# EAGLE board InkTimevf (EAGLE 9.7.0)
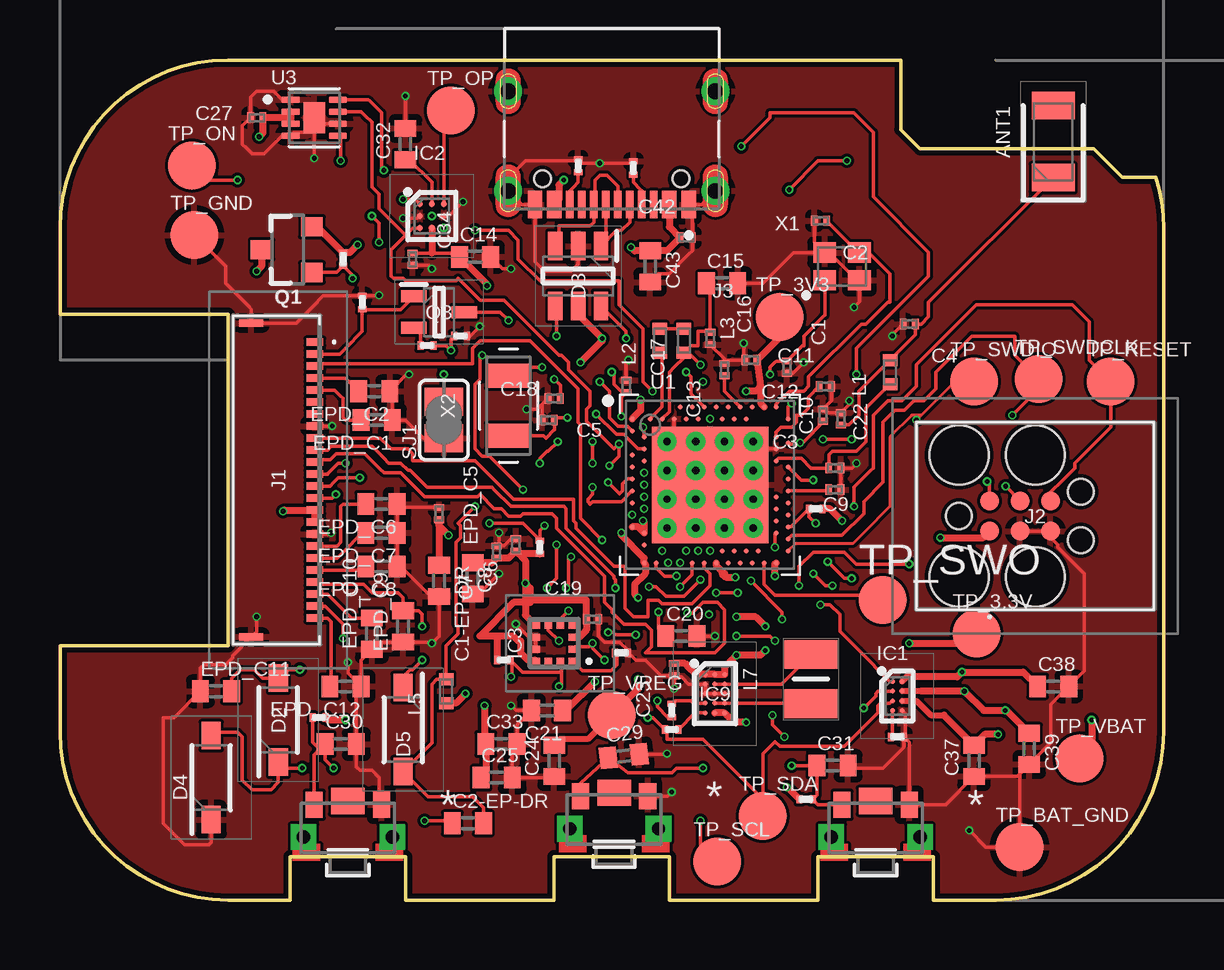
[diagram p5: board, top side]
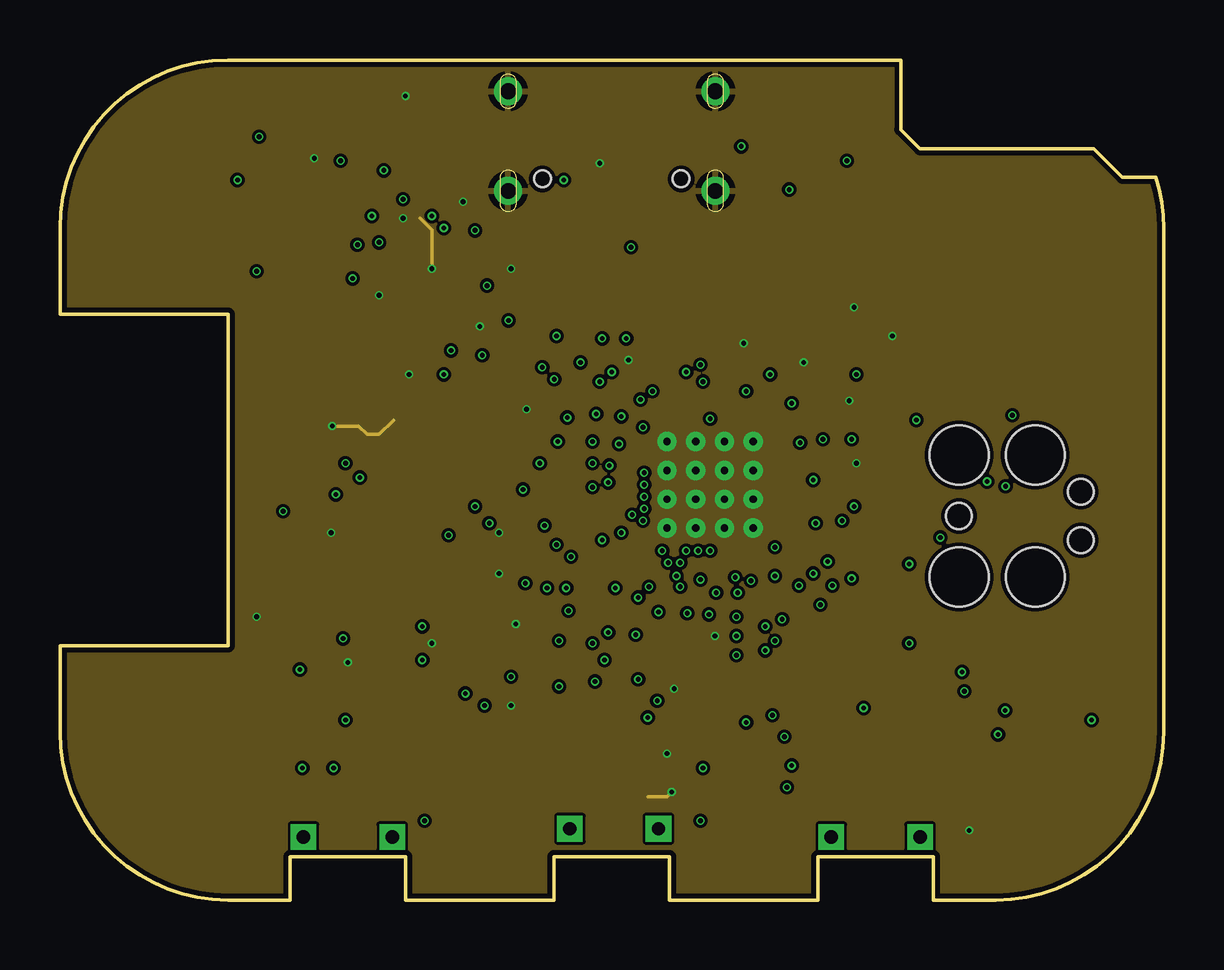
[diagram p6: board, inner layer Route2]
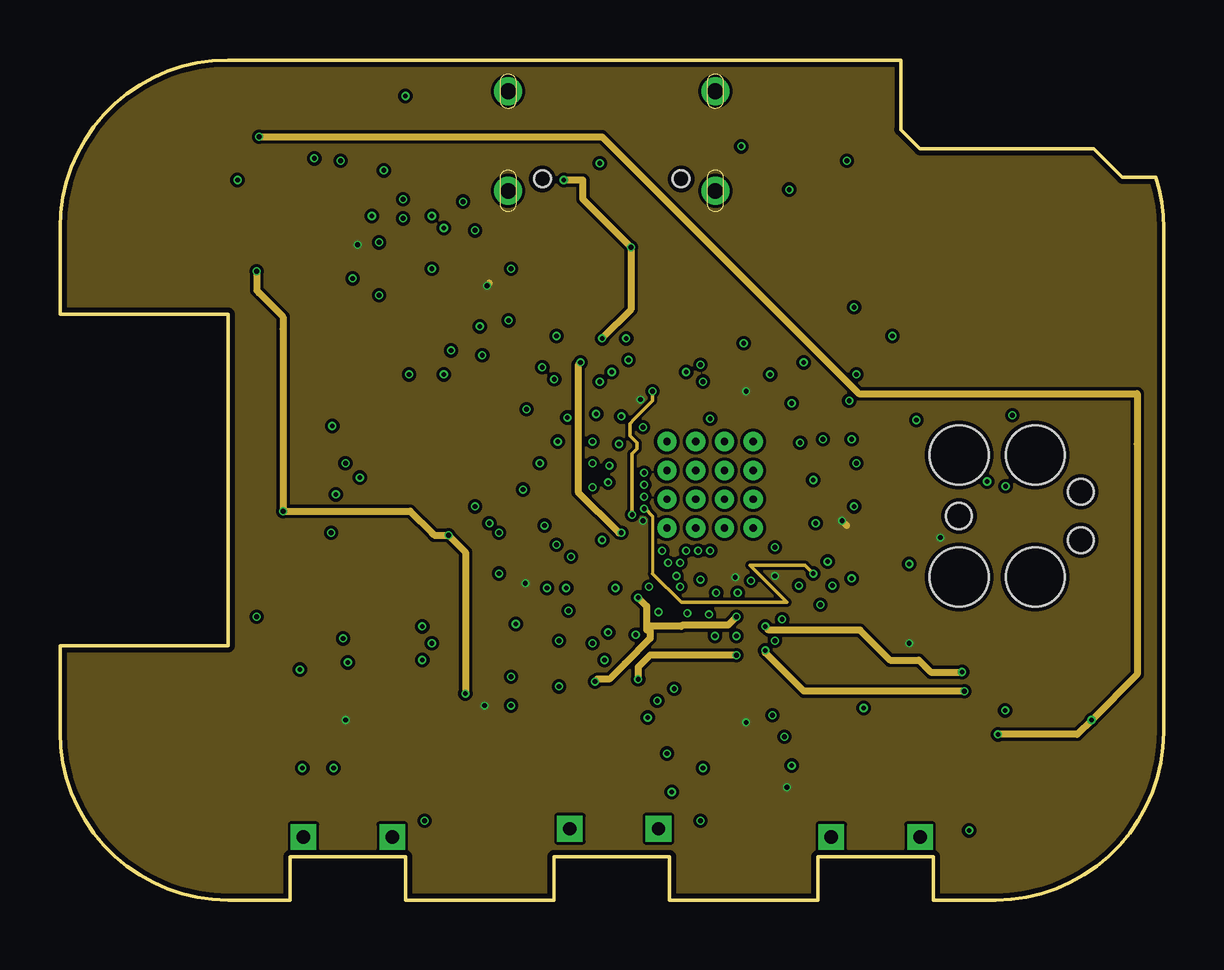
[diagram p7: board, inner layer Route15]
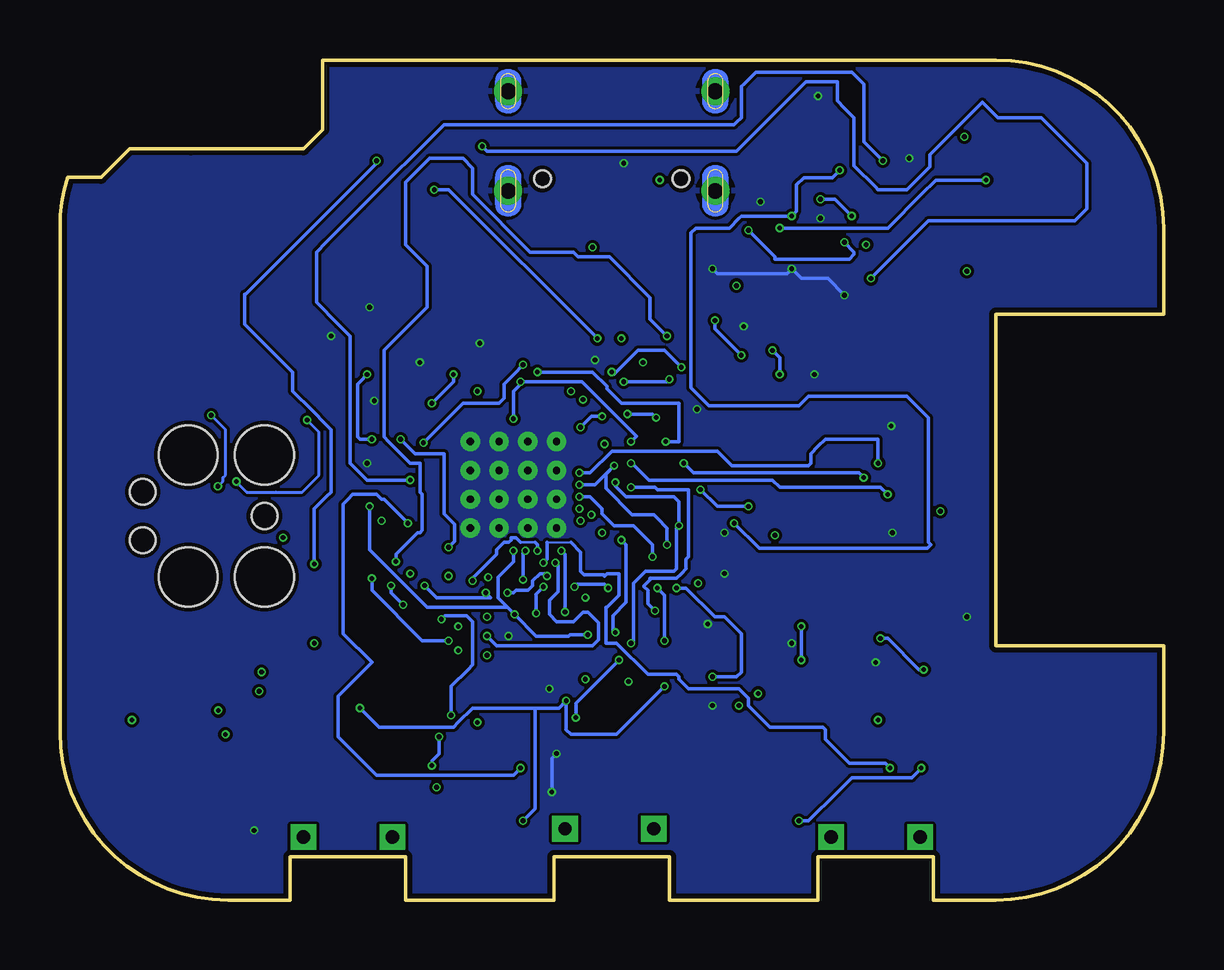
[diagram p8: board, bottom side, seen from below]

Size 46 x 35 mm. Coordinates in mm from the lower left corner, seen from the top.
Outline: 39,0 36.4,0 36.4,1.8 31.6,1.8 31.6,0 25.4,0 25.4,1.8 20.6,1.8 20.6,0 14.4,0 14.4,1.8 9.6,1.8 9.6,0 7,0 arc-90 0,7 0,10.6 7,10.6 7,24.4 0,24.4 0,28 arc-90 7,35 35.05,35 35.05,32.1 35.85,31.3 40.55,31.3 43.1,31.3 44.29,30.11 45.67,30.11 arc-18 46,28 46,7 arc-90 39,0
Copper layers (1+2*15+16): Top 0.035mm / dielectric 1.6mm / Route2 0.035mm / dielectric 0.15mm / Route15 0.035mm / dielectric 0.2mm / Bottom 0.035mm
Design rules "jlcpcb-2layers.dru *": minimum track width 5mil, minimum drill 0.2mm, track to track 5mil, track to pad 5mil, pad to pad 5mil, via to via 5mil, smd to smd 5mil, copper to edge 0.2mm, drill to drill 6mil, minimum pad ring 10mil, minimum via ring 0.07mm, stop-mask expansion 4mil, vias tented up to drill 999mm, thermal gap 10mil

## Footprints (pad centres in the part's own frame; a part is rotated, then mirrored left to right if it is on the bottom)
2450AT18B100E_ANTC3216X140N = smd 1.15 x 1.8: 1 -1.5,0; 2 1.5,0
NORDIC_NRF_3_RESC0201_L = smd 0.28 x 0.43: 1 -0.255,0; 2 0.255,0
ESP32_C6_LIBRARY_1_ESP32_WROVER_EAGLE-LTSPICE_C0402 = smd 0.7 x 0.9: 1 -0.65,0; 2 0.65,0
ESP32_C6_LIBRARY_5_SOD3716X135N = smd 1.15 x 0.8: 1 -1.75,0; 2 1.75,0
ESP32_C6_LIBRARY_3_SOT95P280X145-6N = smd 1.2 x 0.6: 1 -1.25,0.95; 2 -1.25,0; 3 -1.25,-0.95; 4 1.25,-0.95; 5 1.25,0; 6 1.25,0.95
BQ25180YBGR_BGA8C40P2X4_100X155X50 = smd 0.2 x 0.2: A1 -0.2,0.6; A2 0.2,0.6; B1 -0.2,0.2; B2 0.2,0.2; C1 -0.2,-0.2; C2 0.2,-0.2; D1 -0.2,-0.6; D2 0.2,-0.6
DRV2605YZFR_BGA9C50P3X3_144X144X62 = smd 0.25 x 0.25: A1 -0.5,0.5; A2 0,0.5; A3 0.5,0.5; B1 -0.5,0; B2 0,0; B3 0.5,0; C1 -0.5,-0.5; C2 0,-0.5; C3 0.5,-0.5
BMA423_BMA423 = smd 0.3 x 0.35: 1 -0.75,-0.775; 2 -0.25,-0.775; 3 0.25,-0.775; 4 0.75,-0.775; 7 0.75,0.775; 8 0.25,0.775; 9 -0.25,0.775; 10 -0.75,0.775 | smd 0.35 x 0.3: 5 0.775,-0.25; 6 0.775,0.25; 11 -0.775,0.25; 12 -0.775,-0.25
RT6160AWSC_BGA15C40P3X5_140X230X60 = smd 0.216 x 0.216: A1 -0.4,0.8; A2 0,0.8; A3 0.4,0.8; B1 -0.4,0.4; B2 0,0.4; B3 0.4,0.4; C1 -0.4,0; C2 0,0; C3 0.4,0; D1 -0.4,-0.4; D2 0,-0.4; D3 0.4,-0.4; E1 -0.4,-0.8; E2 0,-0.8; E3 0.4,-0.8
503480-2400_5034802400 = smd 0.3 x 0.7: 1 -5.75,1.525; 2 -5.25,1.525; 3 -4.75,1.525; 4 -4.25,1.525; 5 -3.75,1.525; 6 -3.25,1.525; 7 -2.75,1.525; 8 -2.25,1.525; 9 -1.75,1.525; 10 -1.25,1.525; 11 -0.75,1.525; 12 -0.25,1.525; 13 0.25,1.525; 14 0.75,1.525; 15 1.25,1.525; 16 1.75,1.525; 17 2.25,1.525; 18 2.75,1.525; 19 3.25,1.525; 20 3.75,1.525; 21 4.25,1.525; 22 4.75,1.525; 23 5.25,1.525; 24 5.75,1.525 | smd 0.3 x 1: MP1 -6.54,-1.125; MP2 6.54,-1.125
TC2030-IDC_TC2030IDC = smd 0.783 x 0.783: 1 -0.953,-0.635; 2 -0.953,0.635; 3 0.317,-0.635; 4 0.317,0.635; 5 1.588,-0.635; 6 1.588,0.635 | hole 2.451: -2.223,-2.54; -2.223,2.54; 0.952,-2.54; 0.952,2.54 | hole 1.067: -2.223,0; 2.857,-1.016; 2.857,1.016
KH-TYPE-C-16P_KINGHELM_KH-TYPE-C-16P = smd 0.6 x 1.15: A1_B12 -3.2,4.725; A4_B9 -2.4,4.725; A9_B4 2.4,4.725; A12_B1 3.2,4.725 | smd 0.3 x 1.15: A5 -1.25,4.725; A6 -0.25,4.725; A7 0.25,4.725; A8 1.25,4.725; B5 1.75,4.725; B6 0.75,4.725; B7 -0.75,4.725; B8 -1.75,4.725 | drill 0.65 pad 1.05: SH1 -4.32,0; SH2 4.32,0; SH3 -4.32,4.15; SH4 4.32,4.15 | hole 0.7: -2.89,3.65; 2.89,3.65
NORDIC_NRF_2_RESC0402_L = smd 0.5 x 0.6: 1 -0.5,0; 2 0.5,0
MLP2016SR47MT0S1_INDC2016X100N = smd 1.2 x 2.2: 1 -1.028,0; 2 1.028,0
ESP32_C6_LIBRARY_4_ESP32_C6_LIBRARY_4_ESP32_C6_LIBRARY_4_ESP32_C6_LIBRARY_4_ESP32_WROVER_SPARKFUN-DISCRETESEMI_SOT23-3 = smd 0.8 x 0.9: 1 -0.95,-1; 2 0.95,-1; 3 0,1.1
ESP32_C6_LIBRARY_6_SOT65P210X110-3N = smd 1.05 x 0.5: 1 -1.05,0.65; 2 -1.05,-0.65; 3 1.05,0
CPF0201D7K68C1_0201 = smd 0.35 x 0.25: 1 0,0.275; 2 0,-0.275
ERA-1AEB3401C_0201 = smd 0.35 x 0.25: 1 0,0.275; 2 0,-0.275
ESP32_C6_LIBRARY_7_JUMPER_SJ = smd 1.168 x 1.6: 1 -0.762,0; 2 0.762,0
2025-10-22_07-23-44_LIBRARY_SW_EVP-AKE31A_PAN = smd 0.711 x 1.092: 1 -1.4,-0.972; 2 1.4,-0.972 | drill 0.559 pad 0.914 square: 3 -1.848,0.381; 4 1.848,0.381 | smd 1.397 x 1.092: 5 0,-1.124
HECTOR_WATCH_1_TP20R = smd 2 x 2: TP 0,0
NORDIC_NRF_4_AQFN50P700X700X85_HS-74N = smd 4.85 x 4.85: P$74 0,0 | drill 0.3 pad 0.6: P$75 -1.8,1.8; P$76 -0.6,1.8; P$77 0.6,1.8; P$78 1.8,1.8; P$79 -1.8,0.6; P$80 -0.6,0.6; P$81 0.6,0.6; P$82 1.8,0.6; P$83 -1.8,-0.6; P$84 -0.6,-0.6; P$85 0.6,-0.6; P$86 1.8,-0.6; P$87 -1.8,-1.8; P$88 -0.6,-1.8; P$89 0.6,-1.8; P$90 1.8,-1.8 | smd 0.2 x 0.2: P$A8 -1.25,3.25; P$A10 -0.75,3.25; P$A12 -0.25,3.25; P$A14 0.25,3.25; P$A16 0.75,3.25; P$A18 1.25,3.25; P$A20 1.75,3.25; P$A22 2.25,3.25; P$A23 2.75,3.25; P$AA24 3.25,-2.25; P$AB2 -2.75,-2.5; P$AC5 -2,-2.75; P$AC9 -1,-2.75; P$AC11 -0.5,-2.75; P$AC13 0,-2.75; P$AC15 0.5,-2.75; P$AC17 1,-2.75; P$AC19 1.5,-2.75; P$AC21 2,-2.75; P$AC24 3.25,-2.75; P$AD2 -2.75,-3.25; P$AD4 -2.25,-3.25; P$AD6 -1.75,-3.25; P$AD8 -1.25,-3.25; P$AD10 -0.75,-3.25; P$AD12 -0.25,-3.25; P$AD14 0.25,-3.25; P$AD16 0.75,-3.25; P$AD18 1.25,-3.25; P$AD20 1.75,-3.25; P$AD22 2.25,-3.25; P$AD23 2.75,-3.25; P$B1 -3.25,2.75; P$B3 -2.5,2.75; P$B5 -2,2.75; P$B7 -1.5,2.75; P$B9 -1,2.75; P$B11 -0.5,2.75; P$B13 0,2.75; P$B15 0.5,2.75; P$B17 1,2.75; P$B19 1.5,2.75; P$B24 3.25,2.75; P$C1 -3.25,2.25; P$D2 -2.75,2; P$D23 2.75,2; P$E24 3.25,1.75; P$F2 -2.75,1.5; P$F23 2.75,1.5; P$G1 -3.25,1.25; P$H2 -2.75,1; P$H23 2.75,1; P$J1 -3.25,0.75; P$J24 3.25,0.75; P$K2 -2.75,0.5; P$L1 -3.25,0.25; P$L24 3.25,0.25; P$M2 -2.75,0; P$N1 -3.25,-0.25; P$N24 3.25,-0.25; P$P2 -2.75,-0.5; P$P23 2.75,-0.5; P$R1 -3.25,-0.75; P$R24 3.25,-0.75; P$T2 -2.75,-1; P$T23 2.75,-1; P$U1 -3.25,-1.25; P$U24 3.25,-1.25; P$V23 2.75,-1.5; P$W1 -3.25,-1.75; P$W24 3.25,-1.75; P$Y2 -2.75,-2; P$Y23 2.75,-2
ESP32_C6_LIBRARY_SON50P200X200X80-9N = smd 0.76 x 0.27: 1 -0.985,0.75; 2 -0.985,0.25; 3 -0.985,-0.25; 4 -0.985,-0.75; 5 0.985,-0.75; 6 0.985,-0.25; 7 0.985,0.25; 8 0.985,0.75 | smd 0.9 x 1.3: 9 0,0
NORDIC_NRF_BT-XTAL_2016_N = smd 0.95 x 0.85: 1 -0.725,-0.575; 2 0.725,-0.575; 3 0.725,0.575; 4 -0.725,0.575
XTAL330X1051X90N = smd 1 x 1.8: 1 -1.25,0; 2 1.25,0

## Placement (x,y rotation side)
ANT1  2450AT18B100E_2450AT18B100E  [2450AT18B100E_ANTC3216X140N]  41.4,31.6 90 top
C1  12pF  [NORDIC_NRF_3_RESC0201_L]  30.3,22.2 270 top
C1-EP-DR  10uF  [ESP32_C6_LIBRARY_1_ESP32_WROVER_EAGLE-LTSPICE_C0402]  15.8,13.3 270 top
C2  12pF  [NORDIC_NRF_3_RESC0201_L]  31.7,28.3 180 top
C2-EP-DR  4.7uF/25V  [ESP32_C6_LIBRARY_1_ESP32_WROVER_EAGLE-LTSPICE_C0402]  17,3.2 0 top
C3  1pF  [NORDIC_NRF_3_RESC0201_L]  32.3,18 0 top
C4  1pF  [NORDIC_NRF_3_RESC0201_L]  35.4,24 180 top
C5  100nF  [NORDIC_NRF_3_RESC0201_L]  20.6,20.9 180 top
C6  4.7µF  [ESP32_C6_LIBRARY_1_ESP32_WROVER_EAGLE-LTSPICE_C0402]  17.2,13.4 270 top
C7  100nF  [NORDIC_NRF_3_RESC0201_L]  18.2,14.5 90 top
C8  100nF  [NORDIC_NRF_3_RESC0201_L]  19,14.8 90 top
C9  820pF  [NORDIC_NRF_3_RESC0201_L]  32.3,17.1 0 top
C10  N.C.  [NORDIC_NRF_3_RESC0201_L]  31.8,20.2 90 top
C11  100pF  [NORDIC_NRF_3_RESC0201_L]  31.9,21.4 0 top
C12  100nF  [NORDIC_NRF_3_RESC0201_L]  28.8,22.5 180 top
C13  N.C.  [NORDIC_NRF_3_RESC0201_L]  27.7,22.1 90 top
C14  4.7µF  [ESP32_C6_LIBRARY_1_ESP32_WROVER_EAGLE-LTSPICE_C0402]  17.3,26.8 0 top
C15  1.0µF  [ESP32_C6_LIBRARY_1_ESP32_WROVER_EAGLE-LTSPICE_C0402]  27.6,25.7 0 top
C16  47nF  [NORDIC_NRF_3_RESC0201_L]  27.1,23.4 270 top
C17  12pF  [NORDIC_NRF_3_RESC0201_L]  23.6,21.4 270 top
C18  12pF  [NORDIC_NRF_3_RESC0201_L]  20.35,20 0 top
C19  100nF  [NORDIC_NRF_3_RESC0201_L]  22.2,11.7 0 top
C20  4.7µF  [ESP32_C6_LIBRARY_1_ESP32_WROVER_EAGLE-LTSPICE_C0402]  25.9,11 0 top
C21  4.7µF  [ESP32_C6_LIBRARY_1_ESP32_WROVER_EAGLE-LTSPICE_C0402]  20.3,7.9 180 top
C22  N.C.  [NORDIC_NRF_3_RESC0201_L]  32.55,20.05 90 top
C23  0.1uF  [NORDIC_NRF_3_RESC0201_L]  25.6,9.6 90 top
C24  10uF  [ESP32_C6_LIBRARY_1_ESP32_WROVER_EAGLE-LTSPICE_C0402]  20.6,5.8 90 top
C25  22uF  [ESP32_C6_LIBRARY_1_ESP32_WROVER_EAGLE-LTSPICE_C0402]  18.2,5.1 0 top
C27  0.1uF  [NORDIC_NRF_3_RESC0201_L]  8.2,32.6 180 top
C29  1uF  [ESP32_C6_LIBRARY_1_ESP32_WROVER_EAGLE-LTSPICE_C0402]  23.5,6 6.5 top
C30  1uF  [ESP32_C6_LIBRARY_1_ESP32_WROVER_EAGLE-LTSPICE_C0402]  11.7,6.5 0 top
C31  1uF  [ESP32_C6_LIBRARY_1_ESP32_WROVER_EAGLE-LTSPICE_C0402]  32.2,5.6 0 top
C32  1uF  [ESP32_C6_LIBRARY_1_ESP32_WROVER_EAGLE-LTSPICE_C0402]  14.4,31.5 90 top
C33  22uF  [ESP32_C6_LIBRARY_1_ESP32_WROVER_EAGLE-LTSPICE_C0402]  18.4,6.5 0 top
C34  0.1uF  [NORDIC_NRF_3_RESC0201_L]  14.7,26.7 270 top
C37  1uF  [ESP32_C6_LIBRARY_1_ESP32_WROVER_EAGLE-LTSPICE_C0402]  38.1,5.8 90 top
C38  1uF  [ESP32_C6_LIBRARY_1_ESP32_WROVER_EAGLE-LTSPICE_C0402]  41.4,8.9 0 top
C39  10uF  [ESP32_C6_LIBRARY_1_ESP32_WROVER_EAGLE-LTSPICE_C0402]  40.4,6.3 270 top
C42  0.1uF  [NORDIC_NRF_3_RESC0201_L]  26.1,27.6 0 top
C43  4.7uF  [ESP32_C6_LIBRARY_1_ESP32_WROVER_EAGLE-LTSPICE_C0402]  24.6,26.4 270 top
D2  MBR0530  [ESP32_C6_LIBRARY_5_SOD3716X135N]  9.1,7.5 90 top
D3  ESP32_C6_LIBRARY_3_USBLC6-2SC6Y  [ESP32_C6_LIBRARY_3_SOT95P280X145-6N]  21.6,26 270 top
D4  MBR0530  [ESP32_C6_LIBRARY_5_SOD3716X135N]  6.3,5.1 90 top
D5  MBR0530  [ESP32_C6_LIBRARY_5_SOD3716X135N]  14.3,7.1 270 top
EPD_C1  1uF/50V  [ESP32_C6_LIBRARY_1_ESP32_WROVER_EAGLE-LTSPICE_C0402]  13.2,20 180 top
EPD_C2  1uF/50V  [ESP32_C6_LIBRARY_1_ESP32_WROVER_EAGLE-LTSPICE_C0402]  13.1,21.2 180 top
EPD_C5  0.1uF/50V  [NORDIC_NRF_3_RESC0201_L]  15.8,16.1 270 top
EPD_C6  1uF/50V  [ESP32_C6_LIBRARY_1_ESP32_WROVER_EAGLE-LTSPICE_C0402]  13.4,16.5 180 top
EPD_C7  1uF/50V  [ESP32_C6_LIBRARY_1_ESP32_WROVER_EAGLE-LTSPICE_C0402]  13.4,15.3 180 top
EPD_C8  1uF/50V  [ESP32_C6_LIBRARY_1_ESP32_WROVER_EAGLE-LTSPICE_C0402]  13.4,13.9 180 top
EPD_C9  1uF/50V  [ESP32_C6_LIBRARY_1_ESP32_WROVER_EAGLE-LTSPICE_C0402]  14.3,11.4 90 top
EPD_C10  1uF/50V  [ESP32_C6_LIBRARY_1_ESP32_WROVER_EAGLE-LTSPICE_C0402]  13,11.1 90 top
EPD_C11  1uF/50V  [ESP32_C6_LIBRARY_1_ESP32_WROVER_EAGLE-LTSPICE_C0402]  6.5,8.7 0 top
EPD_C12  1uF/50V  [ESP32_C6_LIBRARY_1_ESP32_WROVER_EAGLE-LTSPICE_C0402]  11.9,8.9 180 top
IC1  BQ25180YBGR_BQ25180YBGR  [BQ25180YBGR_BGA8C40P2X4_100X155X50]  34.9,8.5 0 top
IC2  DRV2605YZFR_DRV2605YZFR  [DRV2605YZFR_BGA9C50P3X3_144X144X62]  15.5,28.5 0 top
IC3  BMA423_BMA423  [BMA423_BMA423]  20.6,10.7 90 top
IC9  RT6160AWSC_RT6160AWSC  [RT6160AWSC_BGA15C40P3X5_140X230X60]  27.3,8.6 0 top
J1  503480-2400_503480-2400  [503480-2400_5034802400]  9.1,17.5 270 top
J2  TC2030-IDC_TC2030-IDC  [TC2030-IDC_TC2030IDC]  39.7,16 0 top
J3  KH-TYPE-C-16P_KH-TYPE-C-16P  [KH-TYPE-C-16P_KINGHELM_KH-TYPE-C-16P]  23,33.7 180 top
L1  3.9nH  [NORDIC_NRF_2_RESC0402_L]  34.6,22 90 top
L2  10µH  [NORDIC_NRF_2_RESC0402_L]  25,23.3 90 top
L3  15nH  [NORDIC_NRF_2_RESC0402_L]  26,23.3 270 top
L5  68uH  [NORDIC_NRF_2_RESC0402_L]  16.1,8.7 90 top
L7  MLP2016SR47MT0S1_FTC252012SR47MBCA  [MLP2016SR47MT0S1_INDC2016X100N]  31.3,9.2 270 top
Q1  20V/4.2A/52mΩ/1.4W  [ESP32_C6_LIBRARY_4_ESP32_C6_LIBRARY_4_ESP32_C6_LIBRARY_4_ESP32_C6_LIBRARY_4_ESP32_WROVER_SPARKFUN-DISCRETESEMI_SOT23-3]  9.5,27.1 90 top
Q3  ESP32_C6_LIBRARY_6_SI1308EDL-T1-GE3  [ESP32_C6_LIBRARY_6_SOT65P210X110-3N]  15.8,24.5 0 top
R1_EP_DR  0.47  [CPF0201D7K68C1_0201]  15.3,23.1 270 top
R1_USB  5k1  [CPF0201D7K68C1_0201]  23.9,30.5 0 top
R2  0  [ERA-1AEB3401C_0201]  25.5,7.1 90 top
R2_EP_DR  10k  [CPF0201D7K68C1_0201]  12.6,24.9 0 top
R2_USB  5k1  [CPF0201D7K68C1_0201]  21.6,30.6 180 top
R3  0  [CPF0201D7K68C1_0201]  23.4,10.3 270 top
R4  0  [ERA-1AEB3401C_0201]  25.5,7.9 180 top
R5  10k  [CPF0201D7K68C1_0201]  10.8,7.6 90 top
R7  10k  [CPF0201D7K68C1_0201]  31.5,16.3 90 top
R8  10k  [CPF0201D7K68C1_0201]  31.1,4.2 270 top
R9  10K  [CPF0201D7K68C1_0201]  34.9,6.8 270 top
R17  3K3  [ERA-1AEB3401C_0201]  18.5,10 90 top
R18  3K3  [ERA-1AEB3401C_0201]  20,14.7 180 top
R_PWR_EPD  10k  [ERA-1AEB3401C_0201]  11.8,26.7 180 top
R_TYPE_SEL  2.2  [CPF0201D7K68C1_0201]  16.7,23.5 270 top
SJ1  [ESP32_C6_LIBRARY_7_JUMPER_SJ]  16,20 90 top
SW_DN  2025-10-22_07-23-44_LIBRARY_EVP-AKE31ASW_EVP-AKE31A_PAN  [2025-10-22_07-23-44_LIBRARY_SW_EVP-AKE31A_PAN]  23.1,3.35 180 top
SW_ENT  2025-10-22_07-23-44_LIBRARY_EVP-AKE31ASW_EVP-AKE31A_PAN  [2025-10-22_07-23-44_LIBRARY_SW_EVP-AKE31A_PAN]  34,3 180 top
SW_UP  2025-10-22_07-23-44_LIBRARY_EVP-AKE31ASW_EVP-AKE31A_PAN  [2025-10-22_07-23-44_LIBRARY_SW_EVP-AKE31A_PAN]  12,3 180 top
TP_3.3V  HECTOR_WATCH_1_TPTP20R  [HECTOR_WATCH_1_TP20R]  38.2,11.1 0 top
TP_3V3  HECTOR_WATCH_1_TPTP20R  [HECTOR_WATCH_1_TP20R]  30,24.3 0 top
TP_BAT_GND  HECTOR_WATCH_1_TPTP20R  [HECTOR_WATCH_1_TP20R]  40,2.2 0 top
TP_GND  HECTOR_WATCH_1_TPTP20R  [HECTOR_WATCH_1_TP20R]  5.6,27.7 0 top
TP_ON  HECTOR_WATCH_1_TPTP20R  [HECTOR_WATCH_1_TP20R]  5.5,30.6 0 top
TP_OP  HECTOR_WATCH_1_TPTP20R  [HECTOR_WATCH_1_TP20R]  16.3,32.9 0 top
TP_RESET  HECTOR_WATCH_1_TPTP20R  [HECTOR_WATCH_1_TP20R]  43.8,21.6 0 top
TP_SCL  HECTOR_WATCH_1_TPTP20R  [HECTOR_WATCH_1_TP20R]  27.4,1.6 0 top
TP_SDA  HECTOR_WATCH_1_TPTP20R  [HECTOR_WATCH_1_TP20R]  29.3,3.5 0 top
TP_SWDCLK  HECTOR_WATCH_1_TPTP20R  [HECTOR_WATCH_1_TP20R]  40.8,21.7 0 top
TP_SWDIO  HECTOR_WATCH_1_TPTP20R  [HECTOR_WATCH_1_TP20R]  38.1,21.6 0 top
TP_SWO  HECTOR_WATCH_1_TPTP20R  [HECTOR_WATCH_1_TP20R]  34.3,12.5 0 top
TP_VBAT  HECTOR_WATCH_1_TPTP20R  [HECTOR_WATCH_1_TP20R]  42.5,5.9 0 top
TP_VREG  HECTOR_WATCH_1_TPTP20R  [HECTOR_WATCH_1_TP20R]  23,7.7 0 top
U1  NORDIC_NRF_4_NRF52840_QF  [NORDIC_NRF_4_AQFN50P700X700X85_HS-74N]  27.1,17.3 0 top
U3  ESP32_C6_LIBRARY_MAX17048G+T10  [ESP32_C6_LIBRARY_SON50P200X200X80-9N]  10.6,32.6 0 top
X1  32MHz  [NORDIC_NRF_BT-XTAL_2016_N]  32.6,26.4 0 top
X2  32.768kHz  [XTAL330X1051X90N]  18.7,20.6 90 top

## Tracks (layer width: path | path; a pad name or v marks a point on that pad's centre or on a via)
3V3  (via drill 0.2)
  Top 0.15: C34.1 15.5,26.95 16.5,26.95 C14.1
  Top 0.3: TP_3V3.TP 30,23.45 C12.1 29.2,21.4 | 29.2,21.4 29.2,20.7 U1.P$A22 | 29.2,21.4 29,21.2 v28.6,21.2 | v24.2,20.85 24.2,20.4 U1.P$B1 | v17.8,25.6 17.8,25.65 C14.1 | IC2.C2 15.5,27.6 15.5,26.95 | v12.4,27.3 12.07,26.98 R_PWR_EPD.2 10.72,28.05 Q1.2 | v24.3,15.8 24.35,15.75 U1.P$Y2 24.1,15.55 U1.P$W1 | IC3.7 19.4,11.88 v19.4,13.2 | v19.4,13.2 19.6,13 19.6,12.7 19.6,12.5 | 19.6,12.5 19.6,12.4 18.9,12.4 17.5,11 18.4,11 | U1.P$AD14 27.35,13.95 27.7,13.6 27.6,13.6 27.75,13.45 v28.15,13.45 | v29.8,13.5 29.8,14 U1.P$AD23 | v32.6,15.8 32.1,16.3 R7.2 | v36.7,15.1 38.48,15.1 J2.1 | v35.4,10.7 37.8,10.7 TP_3.3V.TP | v28.6,7.4 28.1,7.4 IC9.E3 IC9.E2 | v30.3,4.7 30.32,4.7 R8.2 | v17.7,8.1 17.7,6.55 C33.1 17.75,5.3 C25.1 | v11.9,7.5 11.18,7.5 R5.2 | 18.4,11 18.9,11 19.1,10.8 19.2,10.8 19.2,10.3 19.5,10 19.8,10 19.82,9.97 IC3.10 | 18.4,11 18.3,11 18.23,10.93 R17.1 | C6.1 18,14.05 C7.1 18.7,14.25 C8.1 | C8.1 19.4,14.14 v19.4,13.2 | 19.6,12.5 20.8,12.5 21.95,12.5 C19.1 21.95,11.25 21.9,11.2 21.65,10.95 IC3.3 | R18.1 19.12,14.43 C8.1
  Route15 0.3: v17.8,25.6 17.9,25.7 | v32.6,15.8 32.8,15.6
  pour Route15: -3.53,-3.18 49.17,-3.18 50.08,-2.27 50.08,36.87 44.02,42.92 -4.22,42.92
ALERT  (via drill 0.2)
  Top 0.15: U3.5 11.7,31.73 v11.7,30.8 | v31.4,17.5 30.9,17.5 U1.P$J24
  Bottom 0.15: v11.7,30.8 12.5,31.6 12.5,32.7 12.5,34 13,34.5 13.9,34.5 17,34.5 17.5,34 17.6,33.9 17.6,32.9 17.6,32.6 17.8,32.4 17.9,32.3 19.1,32.3 30,32.3 33.4,28.9 34.9,27.4 35.3,27 35.3,24.9 34.4,24 33.9,23.5 33.9,20.2 33.9,18.2 33.2,17.5 v31.4,17.5
D+  (via drill 0.2)
  Top 0.15: D3.4 20.7,24.7 v20.7,23.5 | v32,14.1 32.7,13.4 v33,13.4 | v29.8,10.8 29.6,11 v28.2,11
  Bottom 0.15: v20.7,23.5 21.4,24.2 21.4,25.1 23.1,26.8 24.4,26.8 24.6,27 26.4,27 28.8,29.4 28.8,30.5 29.2,30.9 30.6,30.9 31.6,29.9 31.6,29.1 31.6,27.9 31.6,27.3 30.7,26.4 30.7,24.7 32.4,23 32.5,22.9 32.5,21.1 32.5,19.3 32.3,19.1 31.4,18.2 31,18.2 31,17 30.9,16.9 30.9,15.4 31,15.3 31.1,15.3 32,14.4 v32,14.1 | v33,13.4 33,12.9 30.9,10.8 v29.8,10.8 | v28.2,11 27.8,10.6 24.1,10.6 23.8,10.6 23.7,10.7 23.55,10.85 23.55,11.55 24,12 24.2,12 24.6,11.6 25.2,11.6 25.3,11.6 25.6,11.9 25.6,12.5 25.25,12.85 25.25,13.25 25.25,13.95 U1.P$AD6
  other vias: 25.35,14.05
D-  (via drill 0.2)
  Top 0.15: D3.6 23.6,23.7 v23.6,23.4 | v30.4,29.6 31.6,30.8 v32.8,30.8 | v35.4,14 33.2,14 32.7,14.5 31.4,14.5 30.8,13.9 v30.8,13.1 | v28.25,12.8 v27.35,12.8 | v25.7,13.5 25.2,13.5 24.85,13.85 U1.P$AD4
  Bottom 0.15: v23.6,23.4 29.8,29.6 v30.4,29.6 | v32.8,30.8 32.8,30.7 38.27,25.23 38.3,25.25 38.3,24 36.3,22 36.3,21.9 36.3,21.2 35.5,20.4 34.9,19.8 34.7,19.6 34.7,18.8 34.7,17 34.9,16.8 35.4,16.3 v35.4,14 | v30.8,13.1 30.3,12.6 28.05,12.6 v28.25,12.8 | v27.35,12.8 27.1,12.8 27,12.9 26.5,12.9 26.3,13.1 26.3,13.3 26,13.6 25.8,13.6 v25.7,13.5
DEC1  (via drill 0.2)
  Top 0.15: U1.P$C1 23.65,19.75 23.25,19.75 23.1,19.9 22.9,20.1 22.9,20.8 22.9,21.2 v22.5,21.6 | v20.6,21.7 20.86,21.45 C5.1
  Bottom 0.15: v22.5,21.6 20.7,21.6 v20.6,21.7
DEC3
  Top 0.15: C11.1 31.2,20.95 31.2,20.9 31.2,20.5 30.9,20.2 30.7,20.2 30.7,19.9 30.5,19.7 30.4,19.7 30.3,19.7 30.05,19.7 29.85,19.5 U1.P$D23
DEC4_6  (via drill 0.2)
  Top 0.15: U1.P$B5 25.4,20.35 25.4,20.9 25.4,22 25.6,22.2 26,22.6 L3.2 26.05,22.85 | 26.05,22.85 26.3,23.1 26.6,23.1 26.6,23.7 27.05,23.7 C16.1 27.1,25.55 C15.1 | C10.1 31.8,19.9 31,19.1 30.9,19.1 v30.85,19.05 30.8,19 30.4,19 U1.P$E24 | v26.7,22.3 26.15,22.85 26.05,22.85
  Bottom 0.15: v30.85,19.05 29.2,20.7 27.7,20.7 27.5,20.9 27.5,21.2 27.5,21.5 27,22 26.8,22.2 26.7,22.2 v26.7,22.3
DN
  Top 0.15: J3.A7 22.75,27.45 D3.1 23.2,27.9 23.4,27.9 23.75,28.25 J3.B7
DP
  Top 0.15: D3.3 20.8,27.4 20.8,28.1 22.1,28.1 22.25,28.25 J3.B6 22.3,29.02 22.3,30 22.5,30.2 22.7,30.2 22.8,30.2 23.2,29.8 23.25,29.75 J3.A6
EPD_3V3  (via drill 0.2)
  Top 0.3: Q1.3 8.4,26.4 v8.2,26.2 | v9.3,16.2 9.35,16.25 J1.15 J1.16 | v16.2,15.2 15.8,15.6 EPD_C5.2 C1-EP-DR.1 | v16.9,8.6 16.5,8.2 L5.1
  Route15 0.3: v8.2,26.2 8.2,25.4 8.3,25.3 9.3,24.3 9.3,23.8 v9.3,16.2 14.6,16.2 15.5,15.3 15.6,15.2 v16.2,15.2 16.9,14.5 v16.9,8.6
EPD_BUSY
  Top 0.15: J1.9 13.35,19.25 13.7,18.9 13.8,18.8 14.5,18.8 14.7,18.6 14.7,18.3 16,18.3 17.3,18.3 18.9,16.7 21.4,16.7 21.4,15.8 21.5,15.7 21.5,15.5 23.1,13.9 23.55,13.9 23.55,12.15 23.9,11.8 24.5,11.8 24.5,12.5 24.95,12.5 25.1,12.35 25.55,12.35 26.35,12.35 27.1,13.1 27.1,13.6 26.85,13.85 U1.P$AD12
EPD_CS  (via drill 0.2)
  Top 0.15: J1.12 11.15,17.75 11.2,17.8 11.6,18.2 v11.9,18.2
  Bottom 0.15: v11.9,18.2 11.9,19.2 13,19.2 14.1,19.2 14.4,18.9 14.7,18.6 14.7,18.2 14.8,18.1 16.6,18.1 18,18.1 18.6,18.7 23,18.7 23.9,17.8 U1.P$K2
  other vias: 24.35,17.8
EPD_DC  (via drill 0.2)
  Top 0.15: J1.11 10.72,18.35 11.25,18.35 11.5,18.6 12.7,18.6 13.3,18 13.5,17.8 14.1,17.8 14.2,17.8 14.5,17.5 15.2,16.8 17.4,16.8 17.5,16.9 18.1,16.3 18.4,16.3 18.7,16 19.2,16 19.3,16.1 20.5,16.1 20.7,15.9 20.7,15.5 22.7,13.5 22.7,12.4 23,12.1 23,12 23.5,11.5 24.4,11.5 24.65,11.25 24.65,10.55 24.4,10.3 25.6,10.3 27.3,10.3 27.7,10.7 27.7,12.1 27.4,12.4 26.8,12.4 26.35,11.95 v26.15,11.95 | U1.P$AD10 26.35,13.55 v25.85,13.05
  Bottom 0.15: v26.15,11.95 26.15,12.75 v25.85,13.05
EPD_RST  (via drill 0.2)
  Top 0.15: J1.10 11.15,18.75 11.3,18.9 13,18.9 13.5,18.4 13.7,18.2 14.2,18.2 14.5,17.9 14.6,17.9 15.3,17.2 18,17.2 18.1,17.1 18.8,16.4 21,16.4 21.1,16.3 21.1,15.5 22.1,14.5 23.1,13.5 23.1,13.4 23.15,13.35 v23.15,13 | v24.55,13.05 24.85,13.05 25.25,12.65 26,12.65 v26.7,13.35
  Bottom 0.15: U1.P$AC11 26.7,14.45 v26.7,13.35 | v24.55,13.05 24.45,13.15 23.3,13.15 v23.15,13
  other vias: 26.6,14.55
GDR
  Top 0.15: R2_EP_DR.2 12.6,24.6 | 12.6,24.6 12.6,23.7 11.9,23 11.65,22.75 J1.2 | Q3.1 14.2,24.6 12.6,24.6
GND  (via drill 0.2)
  Top 0.15: EPD_C12.1 12.55,10 EPD_C10.1 13.3,10.75 EPD_C9.1 15.45,10.75 v15.5,10.7 15.8,11 C1-EP-DR.2 15.45,12.65 15,13.1 14.2,13.9 EPD_C8.1 EPD_C7.1 EPD_C6.1 14.2,16.36 EPD_C5.1 | EPD_C12.1 12.35,8.7 C30.2 12.35,5.55 12.5,5.4 13,5.4 13.3,5.1 13.3,4.07 SW_UP.1 | D4.1 6.3,2.4 6.2,2.3 5.2,2.3 4.3,3.2 4.3,4.5 4.3,7.6 4.75,7.6 EPD_C11.1 5.85,9.65 6,9.8 6.9,9.8 7.2,10.1 7.2,10.18 J1.MP2 8.2,11.18 v8.2,11.8 | EPD_C12.1 12,9.45 v12,9.9 | C39.2 40,5.25 TP_BAT_GND.TP 38.6,2.2 v37.9,2.9 | C39.2 39.9,5.15 C37.1 36.92,3.97 SW_ENT.1 35.4,6.57 35.24,6.74 | 35.24,6.74 R9.1 35.17,6.38 34.3,5.5 32.95,5.5 C31.2 | C39.2 41.3,6.55 41.3,6.9 41.3,8.15 C38.2 42.7,9.55 42.7,12.9 42.7,13.6 41.6,14.7 41.6,14.8 41.29,15.11 J2.5 J2.3 | U3.1 9.25,33.35 8.9,33.7 8.2,33.7 8.1,33.6 7.95,33.45 C27.2 7.6,32.26 7.6,31.9 7.6,31.5 7.8,31.3 8,31.1 8.5,31.1 9.25,31.85 U3.4 9.77,32 10.6,32 | TP_GND.TP 6.9,26.4 6.9,25.7 7.9,24.7 7.97,24.62 J1.MP1 9.84,24.04 10.5,24.7 10.97,25.18 R2_EP_DR.1 13.28,25.18 v13.3,25.2 | C34.2 15.36,26.45 v15.5,26.3 | R_TYPE_SEL.1 17.1,23.5 v17.5,23.9 | C32.2 v14.4,33.5 | 10.6,32.5 U3.9 10.6,32 | 10.6,32.5 10.6,32 | 10.6,32 10.6,31.9 | 10.6,31.9 v10.6,30.9 | R1_USB.1 23.82,30.7 v22.5,30.7 21.77,30.7 R2_USB.2 21.52,30.8 19.7,30.8 19.4,30.8 19.3,30.7 18.68,30.08 J3.SH4 19.25,28.98 J3.A12_B1 19.8,26.6 19.9,26.5 20.2,26.2 21.3,26.2 21.6,26.5 D3.2 | v18.8,26.3 18.45,26.3 C14.2 | C2.2 31.45,27.41 X1.4 | X1.4 30.57,26.98 29.7,26.1 29.3,25.7 C15.2 | C4.2 34.7,23.55 v34.7,23.5 | v33.1,24.7 33.2,24.8 33.33,24.93 X1.2 33.23,25.82 32.08,26.98 X1.4 | C23.1 25.64,9.3 25.9,9.3 26.2,9 IC9.B1 IC9.C1 IC9.C2 IC9.C3
  Top 0.15: C23.1 25.05,9.35 24.9,9.5 24.4,10 24,10 23.7,10.3 R3.1 23.68,10.4 23.32,10.75 22.7,10.75 22.45,11 C19.2 | C20.2 27.2,11 v27.3,11 | C29.2 25.27,6.07 v25.3,6.1 | C24.1 20.55,5.1 C25.2 18.85,6.3 C33.2 19.05,7.3 C21.2 19,7.9 v18.8,8.1 | v19,11.5 19.55,10.95 IC3.8 IC3.9 | SJ1.1 15.16,19.24 14.6,19.8 14.4,20 EPD_C1.1 13.85,21.1 EPD_C2.1 14.45,21.9 v14.55,21.9 | J1.8 v11.35,19.75 | J1.17 11.25,15.25 v11.3,15.3 | C23.1 v25.6,8.8 | U1.P$74 U1.P$85 | C18.1 20.09,20.65 C5.2 19.89,20.45 v19.45,20.45 | C17.1 23.6,22.4 v23.7,22.5 | C16.2 27.7,22.55 C13.2 27.84,22.5 C12.2 28.5,22.55 v28.5,23.2 | C11.2 32.16,20.81 C10.2 | C10.2 31.95,20.3 C22.2 32.9,20.66 v32.9,20.8 | C10.2 31.74,20.4 | C9.2 C3.2 33,18 v33.2,18.2 | C1.2 30.55,21.95 v31,22.4 | C43.2 24.95,26.1 25.4,26.1 26.2,26.9 26.36,27.05 C42.2 26.36,28.82 J3.A1_B12 26.75,28.98 J3.SH3 | C8.2 18.8,15.05 18.5,14.75 C7.2 18.3,14.86 v18.3,15.3 | C6.2 17.45,12.75 v18.3,13.6 | U3.6 10.75,32.35 10.6,32.5 | 10.6,32 10.6,31.9 | IC1.D2 35.24,7.76 35.24,6.74 | IC2.B3 16.2,28.5 v16.8,29.1 | U1.P$B7 25.6,19.4 U1.P$75 | IC2.B1 14.9,28.4 v14.3,28.4 | v25.5,4.5 25.32,4.32 SW_DN.1 | U1.P$F23 29.2,18.8 U1.P$78
  Route2 0.15: v15.5,26.3 15.5,27.9 15,28.4 | v25.5,4.5 25.3,4.3 24.5,4.3 | v11.35,19.75 12.45,19.75 12.8,19.4 13.3,19.4 13.9,20
  Bottom 0.15: v13.3,25.2 14,25.9 14.5,25.9 15.1,25.9 v15.5,26.3 15.7,26.1 16.8,26.1 18.6,26.1 v18.8,26.3 | v25.3,6.1 25.5,5.9 v25.5,4.5
  pour Route2: 51.94,40.04 52.22,40.32 -2.02,40.32 -2.04,40.34 -2.43,40.72 -3.52,-4.62 51.92,-4.62 51.92,40.02
  pour Top: 7.06,10.56 7.04,10.54 7.01,10.53 0.07,10.53 0.07,7 0.12,6.22 0.25,5.46 0.46,4.71 0.76,4 1.14,3.32 1.59,2.68 2.1,2.1 2.68,1.59 3.32,1.14 4,0.76 4.71,0.46 5.46,0.25 6.22,0.12 7,0.07 9.53,0.07 9.53,1.81 9.54,1.84 9.56,1.86 9.59,1.88 14.41,1.88 14.44,1.86 14.46,1.84 14.47,1.81 14.47,0.07 20.52,0.07 20.52,1.81 20.54,1.84 20.56,1.86 20.59,1.88 25.41,1.88 25.44,1.86 25.46,1.84 25.48,1.81 25.48,0.07 31.52,0.07 31.52,1.81 31.54,1.84 31.56,1.86 31.59,1.88 36.41,1.88 36.44,1.86 36.46,1.84 36.48,1.81 36.48,0.07 39,0.07 39.78,0.12 40.54,0.25 41.29,0.46 42,0.76 42.68,1.14 43.32,1.59 43.9,2.1 44.41,2.68 44.86,3.32 45.24,4 45.54,4.71 45.75,5.46 45.88,6.22 45.92,7 45.92,28 45.88,28.78 45.75,29.54 45.54,30.29 45.24,31 44.86,31.68 44.41,32.32 43.9,32.9 43.32,33.41 42.68,33.86 42,34.24 41.29,34.54 40.54,34.75 39.78,34.88 39,34.92 7,34.92 6.22,34.88 5.46,34.75 4.71,34.54 4,34.24 3.32,33.86 2.68,33.41 2.1,32.9 1.59,32.32 1.14,31.68 0.76,31 0.46,30.29 0.25,29.54 0.12,28.78 0.07,28 0.07,24.48 7.01,24.48 7.04,24.46 7.06,24.44 7.07,24.41 7.07,10.59
  pour Bottom: 53.14,43.04 53.52,43.42 -2.01,43.42 -2.04,43.44 -5.83,47.23 -7.77,-4.57 -6.07,-6.27 53.12,-6.27 53.12,43.01
HAPTIC_EN  (via drill 0.2)
  Top 0.15: v24.7,21.2 24.3,21.6 24.3,22.3 24.3,23.8 23.9,24.2 23.3,24.8 23.3,25.8 20,25.8 19.1,26.7 19.1,27.5 18.7,27.9 17.5,27.9 v17.3,27.9 | v13.3,27.4 13.3,28.2 v13,28.5 | v14.3,29.2 14.8,29.2 IC2.A1
  Route15 0.15: U1.P$U1 23.85,17.05 23.85,18.6 24.05,18.8 24.05,19.05 23.75,19.35 23.75,19.85 23.95,20.05 24.7,20.8 v24.7,21.2
  Bottom 0.15: v17.3,27.9 16.2,26.8 16.2,26.7 13.2,26.7 13.1,26.7 12.9,26.9 12.9,27 v13.3,27.4 | v13,28.5 13.7,29.2 v14.3,29.2
  other vias: 23.85,16.05
IMU_INT1  (via drill 0.2)
  Top 0.15: IC3.5 20.85,11.7 v21.2,12.05 | v22.2,17.2 22.2,16.9 22,16.7 22,16.6 22.1,16.5 22.2,16.6 23.4,16.6 U1.P$N1
  Bottom 0.15: v21.2,12.05 21.5,12.35 21.5,12.9 21.65,13.05 21.65,13.1 21.4,13.35 21.4,13.4 21.2,13.4 20.3,13.4 20.1,13.6 19.9,13.8 19.9,14 19.9,14.2 19.8,14.3 19.8,17.1 21.1,17.1 21.2,17.2 v22.2,17.2
IMU_INT2  (via drill 0.2)
  Top 0.15: v21.3,14.3 21.2,14.2 21.2,13.1 v21.1,13 | v20.8,10.8 20.35,11.25 IC3.6
  Bottom 0.15: U1.P$P2 23.9,16.8 23.4,16.3 23.4,16.1 23.3,16 22.9,15.6 22.1,15.6 21.3,14.8 v21.3,14.3 | v21.1,13 20.8,12.7 v20.8,10.8
  other vias: 24.35,16.8
LX1
  Top 0.15: IC9.B2 IC9.B3 28.2,9 30.07,9 L7.1
LX2
  Top 0.15: IC9.D2 IC9.D3 31.27,8.2 L7.2
MOSI  (via drill 0.2)
  Top 0.15: J1.14 11.35,16.75 v11.5,16.9 | v22.2,19.1 v22.2,18.2
  Bottom 0.15: v11.5,16.9 11.8,17.2 12.1,17.2 13.4,17.2 16,17.2 16.3,17.5 21.45,17.5 22.15,18.2 v22.2,18.2 | v22.2,19.1 21.98,19.32 24.25,21.6 v26.8,21.6 26.8,21.5 27.1,21.2 U1.P$B13
  other vias: 27.1,20.05
N$1
  Top 0.15: IC1.D1 34.7,6.88 R9.2
N$3
  Top 0.15: L1.1 33.6,20.5 33.6,19.1 33.2,18.7 32.2,18.7 32.05,18.55 C3.1 31.3,18 30.9,18.4 29.95,18.4 U1.P$H23
N$4
  Top 0.15: L3.1 L2.2
N$5
  Top 0.15: IC9.D1 26.4,8.2 26.3,8.3 25.62,8.3 R4.2
N$6  (via drill 0.2)
  Top 0.15: X1.1 31.88,24.38 31.8,24.3 31,23.5 31,23.1 30.95,23.1 C1.1 29.86,22.45 29.8,22.4 29.6,22.2 v29.6,21.9 | U1.P$B24 30.35,20.55 v30.5,20.7
  Bottom 0.15: v30.5,20.7 29.6,21.6 v29.6,21.9
N$7
  Top 0.15: U1.P$A23 29.85,20.65 30.4,21.2 31,21.2 31.2,21.4 31.2,21.8 33.4,24 33.6,24 34.5,24.9 34.6,24.9 34.6,26.1 33.73,26.98 X1.3 33.28,26.98 C2.1
N$8
  Top 0.15: R2.2 26.48,7.8 IC9.E1
N$9  (via drill 0.2)
  Top 0.15: v24.95,12 24.95,11.3 C20.1
  Bottom 0.15: U1.P$AC5 24.95,14.4 v24.95,12
  other vias: 25.1,14.55
N$10  (via drill 0.2)
  Top 0.15: C2-EP-DR.2 17.65,3.85 17.4,4.1 17.2,4.3 15.6,4.3 15.35,4.3 D5.2 15.5,6.55 15.5,7.1 15.5,9 15.7,9.2 L5.2 16.1,10.6 16.6,11.1 16.6,11.4 16.5,11.5 16.5,12.1 16.5,14 16.5,14.8 16.5,14.9 16.7,15.1 16.7,15.6 16.6,15.7 v17.3,16.4 | v19.3,17.1 17.9,18.5 17.8,18.5 17.6,18.5 17.3,18.8 17.3,21.5 17.5,21.7 17.5,22.6 v17.6,22.7 | v18.7,24.15 18.35,24.5 Q3.3
  Bottom 0.15: v17.3,16.4 18.6,16.4 v19.3,17.1 | v18.7,24.15 18.7,23.8 v17.6,22.7
N$11
  Top 0.15: U1.P$N24 31.99,17.05 C9.1
N$12
  Top 0.15: U1.P$A18 27.7,21.2 C13.1
N$13
  Top 0.15: J1.19 11.55,14.25 11.8,14.5 12.6,15.3 EPD_C7.2
N$15  (via drill 0.2)
  Top 0.15: D4.2 6.45,7 7.4,7 7.6,6.8 7.6,5.4 7.6,5 8,4.6 8.8,4.6 9.1,4.9 D2.1 9.35,5.5 v10.1,5.5 | v15.2,3.3 16.25,3.3 C2-EP-DR.1
  Bottom 0.15: v10.1,5.5 10.5,5.1 13,5.1 13.6,4.5 14.8,3.3 v15.2,3.3
N$17  (via drill 0.2)
  Top 0.15: SJ1.2 v16,21.9 | R_TYPE_SEL.2 16.3,23.38 v16.3,22.9 16.1,23.1 R1_EP_DR.1
  Bottom 0.15: v16,21.9 16,22.6 v16.3,22.9
N$18
  Top 0.15: R3.2 23.23,10.2 23.23,9.8 22.98,9.55 21.77,9.55 IC3.1
N$19
  Top 0.15: IC2.A2 15.5,29.9 14.55,30.85 C32.1
N$21
  Top 0.15: J1.4 11.9,21.75 EPD_C2.2
N$22
  Top 0.15: J1.5 11.45,21.25 11.7,21 11.8,20.9 11.8,20.1 11.9,20 EPD_C1.2
N$25
  Top 0.15: L2.1 25.1,22.7 25.1,20.55 U1.P$B3
N$33
  Top 0.15: J1.18 11.55,14.75 11.7,14.9 11.7,16.4 11.8,16.5 12.6,16.5 EPD_C6.2
N$34
  Top 0.15: J1.20 12.6,13.75 EPD_C8.2
N$37
  Top 0.15: J1.22 11.15,12.75 11.9,12 12.15,11.75 EPD_C10.2
N$39
  Top 0.15: J1.24 11.15,11.75 11.3,11.6 11.3,8.95 EPD_C12.2
N$41
  Top 0.15: R2_USB.1 21.6,29.9 21.4,29.7 21.25,29.55 J3.B5
N$42
  Top 0.15: R1_USB.2 23.9,29.9 24.2,29.6 24.25,29.55 J3.A5
OUT+
  Top 0.15: IC2.A3 16,32.6 TP_OP.TP
OUT-  (via drill 0.2)
  Top 0.15: v7.4,30 6.1,30 TP_ON.TP
  Bottom 0.15: IC2.C3 11.5,28 10.1,29.4 9.5,30 v7.4,30
  other vias: 16,28
P0.00  (via drill 0.2)
  Top 0.15: v23.4,20.15 23.4,20.95 C17.2 23.45,21.14 23.1,21.5 23.1,21.9 v23,22 | X2.2 19.05,22.2 v20.1,22.2 | v24.3,19.7 24.35,19.65 U1.P$D2
  Bottom 0.15: v24.3,19.7 23.85,20.15 v23.4,20.15 | v20.1,22.2 20.8,22.9 21.8,22.9 21.9,22.9 22.9,21.9 v23,22
P0.01  (via drill 0.2)
  Top 0.15: X2.1 20.15,19.35 20.25,19.25 20.6,19.6 20.61,19.6 C18.2 20.7,20.1 v21.15,20.1 | v22.35,20.25 23.2,19.4 23.5,19.4 23.7,19.2 24.1,18.8 U1.P$F2
  Bottom 0.15: v22.35,20.25 21.3,20.25 v21.15,20.1
P0.13  (via drill 0.2)
  Top 0.15: R5.1 10.53,6.57 10.7,6.4 10.8,6.5 C30.1 | C30.1 10.6,6.05 SW_UP.2 | C30.1 11.05,5.85 v11.4,5.5
  Bottom 0.076: 25.7,14.9 24.7,14.9
  Bottom 0.15: v11.4,5.5 11.6,5.7 13.1,5.7 14.1,6.7 14.1,7.1 14.2,7.2 16.4,7.2 17.3,8.1 17.3,8.4 17.7,8.8 19.8,8.8 20.2,9.2 20.2,9.3 20.3,9.4 21.5,9.4 22.8,10.7 23.25,10.7 23.25,12.2 23.2,12.2 22.7,12.7 22.7,13.3 22.7,13.6 23.2,13.6 23.3,13.5 23.35,13.55 24.15,13.55 24.3,13.7 24.3,13.9 24.3,14.5 24.7,14.9 | U1.P$AD8 25.7,14.2 25.7,14.9
  other vias: 25.85,14.05
P0.14  (via drill 0.2)
  Top 0.15: SW_ENT.2 31.6,3.97 R8.1 31.55,4.38 C31.1 v30.5,5.6 | v30.2,6.8 29.7,7.3 v29.7,7.7 | v30.1,11.7 30.1,12 v28.8,13.3
  Bottom 0.102: 26.8,14.9 26.2,14.9
  Bottom 0.15: v30.5,5.6 30.5,5.8 30.2,6.1 v30.2,6.8 | v29.7,7.7 29.7,8.9 29,9.6 28.8,9.8 28.8,10.6 28.8,11.6 29.05,11.85 29.95,11.85 v30.1,11.7 | v28.8,13.3 28.8,13.4 27.8,14.4 27.8,14.6 27.5,14.9 27.3,14.9 27.2,15 27.2,15.1 27,15.1 26.8,14.9 | 26.2,14.9 26.1,14.8 U1.P$AC9
  other vias: 26.1,14.55
P1.01  (via drill 0.2)
  Top 0.15: Q1.1 11.53,26.15 R_PWR_EPD.1 12.2,26.02 v12.2,25.9 | v28.4,31.4 29.6,32.6 29.6,32.8 33.1,32.8 33.9,32 33.9,29.9 33.9,29.3 36.2,27 36.2,26 35,24.8 33.7,23.5 33.2,23 v33.2,21.9 | v33,19.2 v31.8,19.2 | v29.8,14.7 29.8,15.25 U1.P$Y23
  Bottom 0.15: v12.2,25.9 9.8,28.3 9.7,28.3 3.7,28.3 3.4,28.6 3.2,28.8 3.2,30.7 5.1,32.6 5.5,32.6 6.9,32.6 7.55,33.25 9.75,31.05 9.75,30.55 10.7,29.6 11.9,29.6 12,29.7 12.9,30.6 12.9,31.3 12.9,32.6 13.3,33 13.6,33.3 13.6,34.1 14.9,34.1 17.8,31.2 28.2,31.2 v28.4,31.4 | v33.2,21.9 33.5,21.6 33.6,21.5 33.6,19.3 33.5,19.2 v33,19.2 | v31.8,19.2 31.2,18.6 30,18.6 30,16.3 | 30,16.3 30,16.1 | v29.8,14.7 29.55,14.95 29.55,15.65 30,16.1 | 30,16.3 30,16.1
P1.02  (via drill 0.2)
  Top 0.15: U1.P$W24 30.48,15.55 R7.1 31.23,15.97 v31.5,15.7 | SW_DN.2 21.7,4.86 C29.1 23.67,5.3 25.5,5.3 25.7,5.5 v26.8,5.5
  Bottom 0.15: v31.5,15.7 32.5,16.7 32.6,16.7 32.8,16.9 33.4,16.9 33.8,16.9 34,16.7 34.2,16.5 34.2,15.8 34.2,11.1 33,9.9 33.75,9.15 34.4,8.5 34.4,7.6 34.4,6.8 34.1,6.5 32.8,5.2 27.1,5.2 v26.8,5.5
PMIC_INT  (via drill 0.2)
  Top 0.15: IC1.A1 34.6,9.1 33.3,10.4 32.5,11.2 32.5,11.9 32.1,12.3 v31.7,12.3 | v32.2,13.1 31.9,13.1 v31.4,13.6
  Route15 0.127: 24.7,16 24.7,13.6
  Route15 0.15: 24.7,16 24.4,16.3 U1.P$T2 | 24.7,13.6 25.9,12.4 30.3,12.4 28.75,13.95 31.05,13.95 v31.4,13.6
  Bottom 0.15: v32.2,13.1 32.2,12.8 v31.7,12.3
  other vias: 24.35,16.3
PREVGH  (via drill 0.2)
  Top 0.15: J1.21 10.72,13.15 12.65,13.15 12.9,12.9 13,12.8 14.1,12.8 14.3,12.6 EPD_C9.2 14.95,12.05 15.1,11.9 v15.1,11.4 | v15.1,10 14.7,9.6 14.6,9.6 14.3,9.3 D5.1
  Bottom 0.15: v15.1,11.4 v15.1,10
PREVGL  (via drill 0.2)
  Top 0.15: J1.23 11.05,12.25 11.3,12 11.8,11.5 v11.8,10.9 | v10,9.6 9.45,9.6 D2.2 8.45,9.25 8.1,9.6 7.5,9.6 7.4,9.5 7.15,9.25 EPD_C11.2
  Bottom 0.15: v11.8,10.9 11.5,10.9 10.2,9.6 v10,9.6
RESE
  Top 0.15: Q3.2 15.03,23.57 R1_EP_DR.2
RESET  (via drill 0.2)
  Top 0.15: v22.6,15 21.7,15.9 21.7,19.8 21.6,19.9 21.6,21.3 20.2,22.7 19.6,23.3 18,23.3 17.5,23.3 17.2,23 17.2,22.35 11,22.35 10.72,22.35 J1.3 | v24,11.05 23.15,11.05 23.05,11.15 v22.85,11.15 | J2.6 41.29,16.99 41.8,17.5 42.3,18 42.3,18.2 42.7,18.6 43.8,19.7 TP_RESET.TP 42.9,22.5 42.9,24.1 42.2,24.8 39.8,24.8 38.2,24.8 36.8,23.4 35.7,22.3 35.7,21.6 35.7,21.4 35.2,20.9 35.1,20.8 34.9,20.8 34.5,20.8 34.2,20.5 33.9,20.2 33.9,19 33.9,18 33.8,17.9 33.1,17.2 v33.1,16.4
  Bottom 0.15: v22.6,15 22.4,14.8 22.4,12.4 22.95,11.85 22.95,11.25 v22.85,11.15 | U1.P$AC13 27.1,14.1 27.75,13.45 27.75,12.6 v27.05,11.9 | v27.05,11.9 26.15,11 24.8,11 24.75,11.05 v24,11.05 | v33.1,16.4 33.1,14.6 30.7,12.2 27.35,12.2 v27.05,11.9
  other vias: 27.1,14.55
RF
  Top 0.15: ANT1.1 36.2,24.9 36.2,24.3 35.9,24 C4.1 35.66,23.55 L1.2 33.3,21.2 33.3,20.2 32.89,19.8 C22.1
SCK  (via drill 0.2)
  Top 0.15: J1.13 11.25,17.25 11.4,17.4 11.6,17.6 v12.5,17.6 | v20,18.2 20,18.4 20.3,18.7 20.35,18.7 v20.75,19.1 | v26.1,22 26.3,21.8 26.3,21.1 U1.P$A12
  Bottom 0.15: v12.5,17.6 12.7,17.8 19.6,17.8 v20,18.2 | v20.75,19.1 20.2,19.1 20.2,20.7 22.6,20.7 23.2,21.3 23.2,21.4 23.8,22 24.2,22 v26.1,22
SCL  (via drill 0.2)
  Top 0.15: R17.2 18.84,9.94 | 18.84,9.94 19.27,9.5 19.7,9.5 20.9,9.5 | IC3.12 20.9,9.88 20.9,9.6 20.9,9.5 | U3.7 12.55,32.85 12.7,32.7 13,32.4 13,31.1 13,30.6 13,29.7 13.3,29.4 13.3,28.8 14.4,27.7 | 14.7,28 IC2.C1 14.7,28 | 14.7,28 14.4,27.7 | 14.4,27.7 13.9,27.2 13.8,27.1 13.8,26 13.9,25.9 14.3,25.9 14.4,25.8 16.5,25.8 16.6,25.9 17.5,25 18.5,25 20.8,22.7 20.9,22.7 21.2,22.4 21.2,22.1 22.1,21.2 22.1,20.6 21.95,20.45 21.95,19.95 23.1,18.8 v23.3,19 23.3,18.5 v22.9,18.1 | v20.7,14.8 20.7,13.4 v20.3,13 | v18.8,9.3 18.84,9.34 18.84,9.94 | 20.9,9.5 20.9,9 v20.8,8.9 | v24.9,8.3 24.9,8.05 25.32,7.62 R4.1 | v33.5,8 34,8.5 34,8.6 34.1,8.7 IC1.B1 | v26.7,3.3 26.7,2.3 TP_SCL.TP
  Bottom 0.15: U1.P$M2 23.7,17.3 v22.9,18.1 23.25,17.75 23.25,17.15 22.15,16.05 22.05,16.05 21.25,16.05 21.1,15.9 20.7,15.5 v20.7,14.8 | v20.3,13 19.9,13 18.7,11.8 18.6,11.8 18.3,11.8 17.7,11.2 17.6,11.1 17.6,9.5 17.8,9.3 v18.8,9.3 | v20.8,8.9 22.8,6.9 24.7,6.9 24.9,7.1 v24.9,8.3 25.2,8 26.2,8 | 26.2,8 28.6,8 28.8,8 29.4,7.4 29.6,7.2 31.5,7.2 32.7,7.2 v33.5,8 | 26.2,8 26.2,3.8 v26.7,3.3
  other vias: 24.35,17.3
SDA  (via drill 0.2)
  Top 0.15: U3.8 12.85,33.35 12.9,33.3 13.4,32.8 13.4,30.8 13.4,30.5 v13.5,30.4 | v17.9,15.7 19.3,15.7 19.4,15.6 20,15 R18.2 20,15.4 v20.2,15.6 | U1.P$L1 23.65,17.55 23.45,17.35 23.45,17.05 23.32,16.93 v22.85,17.4 | IC3.2 21.48,10.55 22.05,10.55 v22.2,10.7 22.2,10.5 v22.7,10 | v24.5,7.6 24.73,7.6 R2.1 25.3,7.03 25.3,6.7 26.8,6.7 29.3,4.2 TP_SDA.TP 29.3,6.1 29.8,6.6 30,6.4 32.7,6.4 33.6,7.3 34.1,7.8 34.1,8.1 34.2,8.2 34.6,8.2 IC1.C1
  Bottom 0.15: v13.5,30.4 13.8,30.1 14.7,30.1 15,30.1 15.3,29.8 15.3,28.7 IC2.B2 17.6,28.5 17.7,28.4 18.1,28 18.5,28 19.5,28 19.7,27.8 19.7,21.35 18.95,20.6 15.2,20.6 14.8,21 10.7,21 10.2,20.5 9.8,20.1 9.8,19.7 9.8,14.9 9.7,14.8 9.85,14.65 16.85,14.65 v17.9,15.7 | v22.85,17.4 22.85,17.25 22.4,16.8 20.4,16.8 20.2,16.6 v20.2,15.6 20.3,15.5 20.3,13.8 20.4,13.7 21.6,13.7 22.1,13.2 22.1,12.2 22.1,10.8 v22.2,10.7 | v22.7,10 24.5,8.2 v24.5,7.6
  other vias: 15.5,28.5
SWDCLK  (via drill 0.2)
  Top 0.15: v39.7,20.2 40.8,21.3 TP_SWDCLK.TP 39.8,22.7 39.8,23.5 38,23.5 | 36.5,22 36.5,21.3 36,20.8 35.6,20.8 35.2,20.4 34.8,20.4 34.3,19.9 34.3,18.8 34.3,17.4 33.5,16.6 33.5,16.1 32.6,15.2 30.5,15.2 U1.P$AA24 | v39.42,17.23 J2.4
  Top 0.152: 38,23.5 36.5,22
  Bottom 0.127: v39.42,17.23 39.2,17.45 39.2,17.6 39.1,17.7 39.1,18.8 39.1,19.6 v39.7,20.2
SWDIO  (via drill 0.2)
  Top 0.127: v35.7,20 36.25,20.55 | 36.25,20.55 37.3,21.6 TP_SWDIO.TP | 36.25,20.55 35.9,20.2 35.5,20.2 34.6,19.3 34.6,18.7 34.6,16.4 33.5,15.3 33.05,14.85 30.65,14.85 U1.P$AC24
  Top 0.15: v38.65,17.43 38.75,17.34 J2.2
  Bottom 0.127: v38.65,17.43 38.21,17 37,17 35.9,17 35.6,17.3 35.2,17.7 35.2,18.5 35.2,19.5 v35.7,20
SWO
  Top 0.15: U1.P$AD22 29.35,13.15 29.4,13.1 29.8,12.7 30.9,12.7 34.1,12.7 TP_SWO.TP
VBAT  (via drill 0.2)
  Top 0.254: IC1.C2 35.7,8.3 35.8,8.2 36.3,7.7 36.85,7.7
  Top 0.3: U3.2 U3.3 9.37,32.6 C27.1 8.46,31.95 v8.3,31.8 | 43,6.4 TP_VBAT.TP 43,6.4 | v43,7.5 43,6.4 | v39.1,6.9 38.55,6.9 C37.2 36.85,7.7
  Route15 0.3: v8.3,31.8 22.2,31.8 22.6,31.8 33.3,21.1 44.9,21.1 44.9,19 44.9,9.4 v43,7.5 42.4,6.9 v39.1,6.9
VBUS  (via drill 0.2)
  Top 0.254: 35.3,9.3 IC1.A2
  Top 0.3: J3.A4_B9 25.4,28.05 C42.1 25.3,27.05 C43.1 23.95,27.05 v23.8,27.2 | v21,30 20.8,29.8 20.8,29.4 20.8,29.18 J3.A9_B4 | D3.5 21.6,24.4 v22.6,23.4 22.6,23.3 v21.7,22.4 | v23.4,15.3 23.4,15.2 24.35,14.25 U1.P$AD2 24.4,14 24.4,13.6 23.95,13.15 23.95,12.75 v24.1,12.6 | v22.3,9.1 21.1,7.9 C21.1 | v29.4,11.4 29,11.8 v28.2,11.8 | 35.3,9.3 37.4,9.3 v37.6,9.5 40.15,9.5 C38.1
  Route15 0.3: v21,30 21.8,30 21.8,29.2 v23.8,27.2 23.8,24.6 v22.6,23.4 | v21.7,22.4 21.6,22.3 21.6,17 23.3,15.3 v23.4,15.3 | v24.1,12.6 24.45,12.25 24.45,11.25 24.6,11.4 | v22.3,9.1 22.4,9.2 22.9,9.2 23.55,9.85 24.6,10.9 24.6,11.4 | v28.2,11.8 27.85,11.45 25.95,11.45 25.9,11.4 24.6,11.4 | v29.4,11.4 29.55,11.25 33.35,11.25 34.6,10 35.8,10 36.3,9.5 v37.6,9.5
VREG  (via drill 0.2)
  Top 0.254: 35.9,8.7 IC1.B2 | C24.2 20.85,6.7 22,6.7 TP_VREG.TP
  Top 0.3: C39.1 39.45,7.9 v39.4,7.9 38.5,7.9 v37.7,8.7 35.9,8.7 | v29.4,10.4 29.2,10.2 v28.2,10.2 27.7,9.7 IC9.A3 IC9.A2 IC9.A1 26.5,9.4 26.2,9.7 26.05,9.86 C23.2 | v24.1,9.2 24.1,8.8 TP_VREG.TP
  Route15 0.3: v37.7,8.7 31,8.7 29.4,10.3 v29.4,10.4 | v28.2,10.2 24.6,10.2 24.1,9.7 v24.1,9.2
(copper drawn outside any net)
  shapes: Bottom area x2, Route15 area x1, Route2 area x1, Top area x1